# Altium project test1.PrjPcb
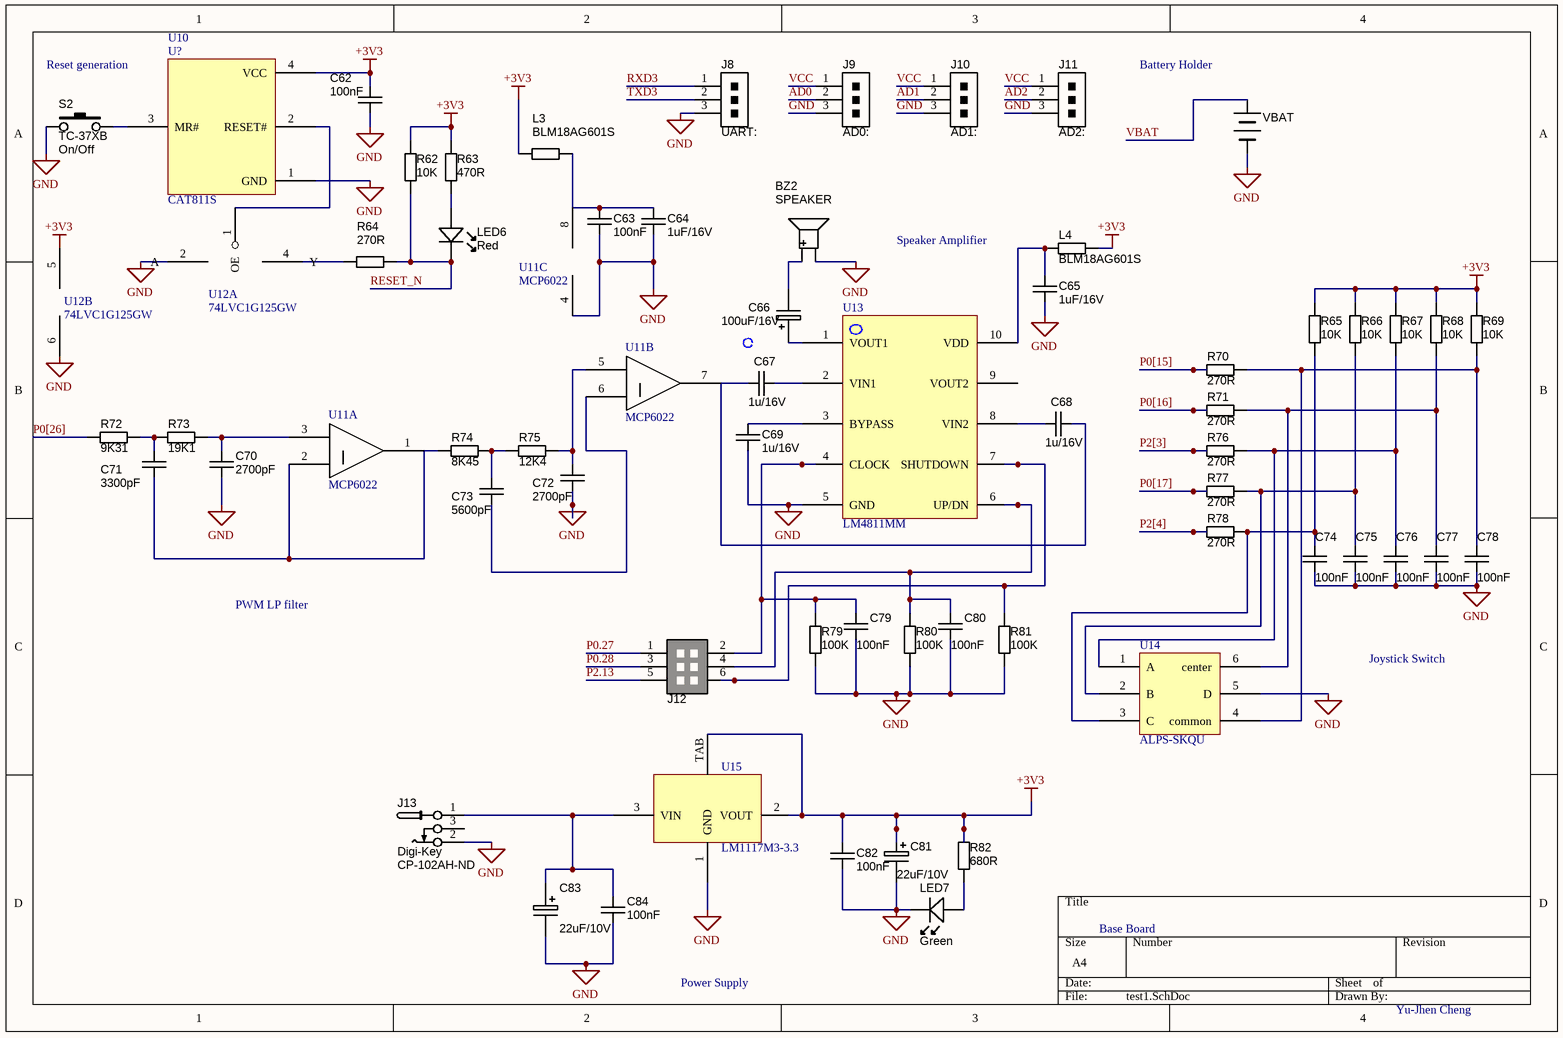
[diagram p0: test1.SchDoc]
1 sheet, 63 parts. Net scope: global (net labels, ports and power ports of the same name join across sheets).
Board files: test1.PcbDoc, all test.PcbDoc

## Sheet test1.SchDoc
size A4

### Parts
BZ2  Manufacturer Part Number 1: SPEAKER  [BUZZER_12.0X8.5MM]  (hidden comment: Alternate part: 3100-932)
C62  value 100nF  [CAPC2012N]  (hidden comment: approved sub OK)
C63  value 100nF  [CAPC2012N]  (hidden comment: approved sub OK)
C64  value 1uF/16V  [CAPC2012N]  (hidden comment: approved sub OK)
C65  value 1uF/16V  [CAPC2012N]  (hidden comment: approved sub OK)
C66  (no value)  [CAPMP3528X210N]
C67  value 1u/16V  [CAPC2012N]  (hidden comment: approved sub OK)
C68  value 1u/16V  [CAPC2012N]  (hidden comment: approved sub OK)
C69  value 1u/16V  [CAPC2012N]  (hidden comment: approved sub OK)
C70  value 2700pF  [CAPC2012N]  (hidden comment: approved sub OK)
C71  value 3300pF  [CAPC2012N]  (hidden comment: approved sub OK)
C72  value 2700pF  [CAPC2012N]  (hidden comment: approved sub OK)
C73  value 5600pF  [CAPC2012N]  (hidden comment: approved sub OK)
C74  value 100nF  [CAPC2012N]  (hidden comment: approved sub OK)
C75  value 100nF  [CAPC2012N]  (hidden comment: approved sub OK)
C76  value 100nF  [CAPC2012N]  (hidden comment: approved sub OK)
C77  value 100nF  [CAPC2012N]  (hidden comment: approved sub OK)
C78  value 100nF  [CAPC2012N]  (hidden comment: approved sub OK)
C79  value 100nF  [CAPC2012N]  (hidden comment: approved sub OK)
C80  value 100nF  [CAPC2012N]  (hidden comment: approved sub OK)
C81  (no value)  [CAPMP3528X210N]
C82  value 100nF  [CAPC2012N]  (hidden comment: approved sub OK)
C83  (no value)  [CAPMP3528X210N]
C84  value 100nF  [CAPC2012N]  (hidden comment: approved sub OK)
J8  CONN_HEADER_1x3P_0.100in  [1x3POS_HEADER]  (value not drawn)
J9  CONN_HEADER_1x3P_0.100in  [1x3POS_HEADER]  (value not drawn)
J10  CONN_HEADER_1x3P_0.100in  [1x3POS_HEADER]  (value not drawn)
J11  CONN_HEADER_1x3P_0.100in  [1x3POS_HEADER]  (value not drawn)
J12  micro-match socket  [6P_PCB_SOCKET_BRD_MNT_MICRO-MATCH]  (value not drawn)
J13  Supplier 1: Digi-Key  Supplier Part Number 1: CP-102AH-ND  [CONN_PWR_JACK_2.1x5.5mm]  (hidden comment: CONN_PWR_JACK_2.1x5.5mm)
L3  value BLM18AG601S  [RESC2012N]  (hidden comment: Thick Film)
L4  value BLM18AG601S  [RESC2012N]  (hidden comment: Thick Film)
LED6  Red  [LED-0805-A]
LED7  Green  [LED-0805-K]
R62  value 10K  [RESC2012N]  (hidden comment: Thick Film)
R63  value 470R  [RESC1608N]  (hidden comment: Thick Film)
R64  value 270R  [RESC1005N]  (hidden comment: Thick Film)
R65  value 10K  [RESC2012N]  (hidden comment: Thick Film)
R66  value 10K  [RESC2012N]  (hidden comment: Thick Film)
R67  value 10K  [RESC2012N]  (hidden comment: Thick Film)
R68  value 10K  [RESC2012N]  (hidden comment: Thick Film)
R69  value 10K  [RESC2012N]  (hidden comment: Thick Film)
R70  value 270R  [RESC1005N]  (hidden comment: Thick Film)
R71  value 270R  [RESC1005N]  (hidden comment: Thick Film)
R72  value 9K31  [RESC1005N]  (hidden comment: Thick Film)
R73  value 19K1  [RESC1005N]  (hidden comment: Thick Film)
R74  value 8K45  [RESC1005N]  (hidden comment: Thick Film)
R75  value 12K4  [RESC1005N]  (hidden comment: Thick Film)
R76  value 270R  [RESC1005N]  (hidden comment: Thick Film)
R77  value 270R  [RESC1005N]  (hidden comment: Thick Film)
R78  value 270R  [RESC1005N]  (hidden comment: Thick Film)
R79  value 100K  [RESC1005N]  (hidden comment: Thick Film)
R80  value 100K  [RESC1005N]  (hidden comment: Thick Film)
R81  value 100K  [RESC1005N]  (hidden comment: Thick Film)
R82  value 680R  [RESC1005N]  (hidden comment: Thick Film)
S2  Manufacturer Part Number 1: TC-37XB  Function: On/Off  [SWITCH_TACT-EVQPQxB55]  (hidden comment: SW_THT_PB_5.0mm)
U10  CAT811S  [SOT-143-RC4_N]
U11  MCP6022  [MSOP-UA8_L]  (parts A,B,C of 3)
U12  74LVC1G125GW  [SOT-23-CT5_N]  (parts A,B of 2)
U13  LM4811MM  [MSOP-UN10_N]
U14  ALPS-SKQU  [SOT-23-CH6_L]
U15  LM1117M3-3.3  [SOT-89-MB3_M]
VBAT  (no value)  [PCBComponent_1]  (no BOM)

### Nets
+3V3: C62.1 C81.1 C82.2 L3.1 L4.2 R62.1 R63.1 R65.1 R66.1 R67.1 R68.1 R69.1 R82.2 U10.4(VCC) U15.2(VOUT) U15.TAB
GND: BZ2.2(Negative) C62.2 C63.1 C64.1 C65.1 C69.1 C70.2 C72.2 C74.2 C75.2 C76.2 C77.2 C78.2 C79.2 C80.2 C81.2 C82.1 C83.2 C84.1 J8.3 J9.3 J10.3 J11.3 J13.2 LED7.K R79.1 R80.1 R81.1 S2.1 U10.1(GND) U13.5(GND) U14.5(D) U15.1(GND) VBAT.2
AD0: J9.2
AD1: J10.2
AD2: J11.2
P0.27: J12.1
P0.28: J12.3
P0[15]: R70.1
P0[16]: R71.1
P0[17]: R77.1
P0[26]: R72.1
P2.13: J12.5
P2[3]: R76.1
P2[4]: R78.1
RESET_N: LED6.K R62.2 R64.2
RXD3: J8.1
TXD3: J8.2
VBAT: VBAT.1
VCC: J9.1 J10.1 J11.1
NetBZ2_1: BZ2.1(Positive) C66.2
NetC63_2: C63.2 C64.2 L3.2
NetC65_2: C65.2 L4.1 U13.10(VDD)
NetC66_1: C66.1 U13.1(VOUT1)
NetC67_1: C67.1 C68.2
NetC67_2: C67.2 U13.2(VIN1)
NetC68_1: C68.1 U13.8(VIN2)
NetC69_2: C69.2 U13.3(BYPASS)
NetC70_1: C70.1 R73.2
NetC71_1: C71.1 R72.2 R73.1
NetC71_2: C71.2 R74.2
NetC72_1: C72.1 R75.2
NetC73_1: C73.1 R74.1 R75.1
NetC74_1: C74.1 R65.2 R78.2 U14.3(C)
NetC75_1: C75.1 R66.2 R77.2 U14.2(B)
NetC76_1: C76.1 R67.2 R76.2 U14.1(A)
NetC77_1: C77.1 R68.2 R71.2 U14.6(center)
NetC78_1: C78.1 R69.2 R70.2 U14.4(common)
NetC79_1: C79.1 J12.2 R79.2 U13.4(CLOCK)
NetC80_1: C80.1 J12.4 R80.2 U13.6(UP/DN)
NetC83_1: C83.1 C84.2 J13.1 U15.3(VIN)
NetJ12_6: J12.6 R81.2 U13.7(SHUTDOWN)
NetLED6_A: LED6.A R63.2
NetLED7_A: LED7.A R82.1
NetS2_2: S2.2 U10.3(MR#)
NetU10_2: U10.2(RESET#) U12.1(OE)

Not connected (* = marked no-connect by the designer): C73 2; J13 3; R64 1; U11 1(VOUTA) 2(VINA-) 3(VINA+) 4(GND) 5(VINB+) 6(VINB-) 7(VOUTB) 8(VDD); U12 2(A) 4(Y) 5(VCC) 6(GND); U13 9(VOUT2)

### Notes on the sheet
- (near U10) Reset generation
- (near VBAT) Battery Holder
- Speaker Amplifier
- PWM LP filter
- Joystick Switch
- Power Supply
- Base Board
- Yu-Jhen Cheng
- Labels drawn without touching a wire or pin: +3V3, GND
- (in symbol CAPT_100u_1210_6V3) 100uF/16V; 22uF/10V
- (in symbol CAT811S) U?

### Library data of the parts
BZ2 = BZ_12x8.5x6.5_2kHz: Speaker, Magnetic Transducer; Manufacturer 1: CUI Inc; Ratings: 2048 ?00 Hz; Package / Case: 6.5mm pitch; Material: Noryl SE1-J; Supplier 1: Digi-Key; Supplier Part Number 1: 102-1152-ND
C62-C65 C67-C80 C82 C84 = CAPC_100n_0805: Capacitor SMD Cer 100nF 10% 50V X7R 0805; Manufacturer 1: Kemet; Manufacturer Part Number 1: C0805C104K5RACTU; Tolerance: ?0%; Ratings: 50V; X7R; Material: ceramic; Package / Case: 0805 (2012 metric); Supplier 1: Digi-Key; Supplier Part Number 1: 399-1170-1-ND
C66 C81 C83 = CAPT_100u_1210_6V3: Capacitor SMD Tantalum 100uF 20% 6.3V 1210; Manufacturer 1: AVX Corporation; Manufacturer Part Number 1: TCJB107M006R0045; Tolerance: ?0%; Package / Case: 1210 (3528 Metric); Material: Tantalum; Supplier 1: Digi-Key; Supplier Part Number 1: 478-4711-1-ND
J8-J11 = CONN_HEADER_1x3P_0.100in: Pin Header, THT, Single-row, 2.54mm pitch; Manufacturer 1: 3M; Manufacturer Part Number 1: 929647-09-36-I; Pitch: 0.100" (2.54mm); Value: Single-row, 3 positions; QtyOverride: 0.1; Category: Connectors; Mounting Type: Through Hole; Terminal Block Type: Header, Male Pins, Single; Package / Case: Pin header; 2.54mm pitch
J12 = CONN_SOCKET_2x3P_0.100in_Female: Socket THD 6 POS Double-row 2.54mm pitch; Manufacturer 1: TE Connectivity; Manufacturer Part Number 1: 7-215079-6; Pitch: 0.100" (2.54mm); Value: Double-row, 14 positions; QtyOverride: 1; Connector Type: Receptacle; Number of Positions: 6; Package / Case: Connector header; 2.54mm pitch; Contact Type: Female Socket; Number of Rows: 2; Row Spacing: 0.100" (2.54mm); Contact Mating Length: 0.243" (6.17mm); ComponentLink1URL: http://multimedia.3m.com/mws/mediawebserver?66666UuZjcFSLXTtm8T_oxMcEVuQEcuZgVs6EVs6E666666--; ComponentLink1Description: http://multimedia.3m.com/mws/mediawebserver?66666UuZjcFSLXTtm8T_oxMcEVuQEcuZgVs6EVs6E666666--; Supplier 1: Digi-Key; Supplier Part Number 1: A30729CT-ND
J13 = CONN_PWR_JACK_2.1x5.5mm: Power Connector, THT, 2.1mm ID, 5.5mm OD; Manufacturer 1: CUI Inc; Manufacturer Part Number 1: PJ-102AH; Category: Connectors; Mounting Type: Through Hole; Package / Case: PCB mount; Value: 2.1mm ID, 5.5mm OD
L3 L4 R62 R65-R69 = RES_10K_0805_5%: Resistor SMD chip 10k Ohm 0.125W 5% 0805; Manufacturer 1: Yageo; Manufacturer Part Number 1: RC0805JR-0710KL; Ratings: 1/8 W; Tolerance: ?%; Package / Case: 0805 (2012 metric); Material: Thick Film; Supplier 1: Digi-Key; Supplier Part Number 1: 311-10KARCT-ND
LED6 = LED_SMD_Red_0805: LED, 0805 SMD, Red; Manufacturer 1: Ligitek; Manufacturer Part Number 1: LG170SR-CT; Material: GaAIAs; Ratings: 20 mcd; 643 nm; Package / Case: 0805
LED7 = LED_SMD_Green_0805_8mcd: LED, 0805 SMD, Green; Manufacturer 1: Ligitek; Manufacturer Part Number 1: LG-170PG-CT; Material: GaP; Ratings: 8 mcd; 558 nm; Package / Case: 0805
R63 = RES_470R_0603_5%: Resistor SMD chip 470 Ohm 0.1W 5% 0603; Manufacturer 1: Vishay/Dale; Manufacturer Part Number 1: CRCW0603470RJNEA; Ratings: 1/10 W; Tolerance: ?%; Package / Case: 0603 (1608 metric); Material: Thick Film; Supplier 1: Digi-Key; Supplier Part Number 1: 541-470GCT-ND
R64 R70-R82 = RES_330R_0402_5%: Resistor SMD chip 330 Ohm 0.063W 5% 0402; Manufacturer 1: Yageo; Manufacturer Part Number 1: RC0402JR-07330RL; Ratings: 1/16 W; Tolerance: ?%; Package / Case: 0402 (1005 Metric); Supplier 1: Digi-Key; Supplier Part Number 1: 311-330JRCT-ND; ComponentLink1URL: http://www.yageo.com/documents/recent/PYu-RC0402_51_RoHS_L_6.pdf; ComponentLink1Description: http://www.yageo.com/documents/recent/PYu-RC0402_51_RoHS_L_6.pdf
S2 = SW_THT_PB_5.0mm: Switch, tact, 5.0mm stem; Manufacturer 1: Wealth Metal; Package / Case: 6.5x6.5mm; 5.0mm stem; Material: Brass/Nylon/Ag plating
VBAT = BATT_AAAx2_600mAh: Battery pack, 2-cell AAA; Manufacturer 1: JJJ; Manufacturer Part Number 1: NiMH-AAA-2-600-PB7; Ratings: 600 mAh; Package / Case: per dwg